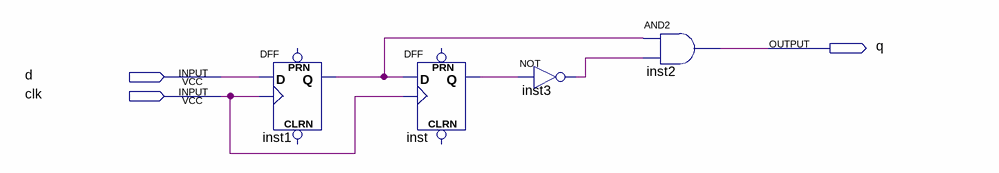
[diagram p0: schematic sheet]
// Quartus schematic imp_pe.bdf as structural Verilog: 4 symbols, 3 pins
module imp_pe (
  input  d,
  input  clk,
  output q
);

  wire inst1_q, inst3_out, inst_q;

  DFF inst1 (.CLK(clk), .D(d), .Q(inst1_q));  // open: CLRN, PRN
  DFF inst (.CLK(clk), .D(inst1_q), .Q(inst_q));  // open: CLRN, PRN
  not inst3 (inst3_out, inst_q);
  and inst2 (q, inst1_q, inst3_out);
endmodule
